# Altium schematic sheet NeuronSynapseVersion3 (1).SchDoc
size 431 x 279 mm; SheetNumber: 1; SheetTotal: 1; SPICEModelCacheKXTIQRLV: <root> / <DocumentId>KXTIQRLV</DocumentId> / </root>
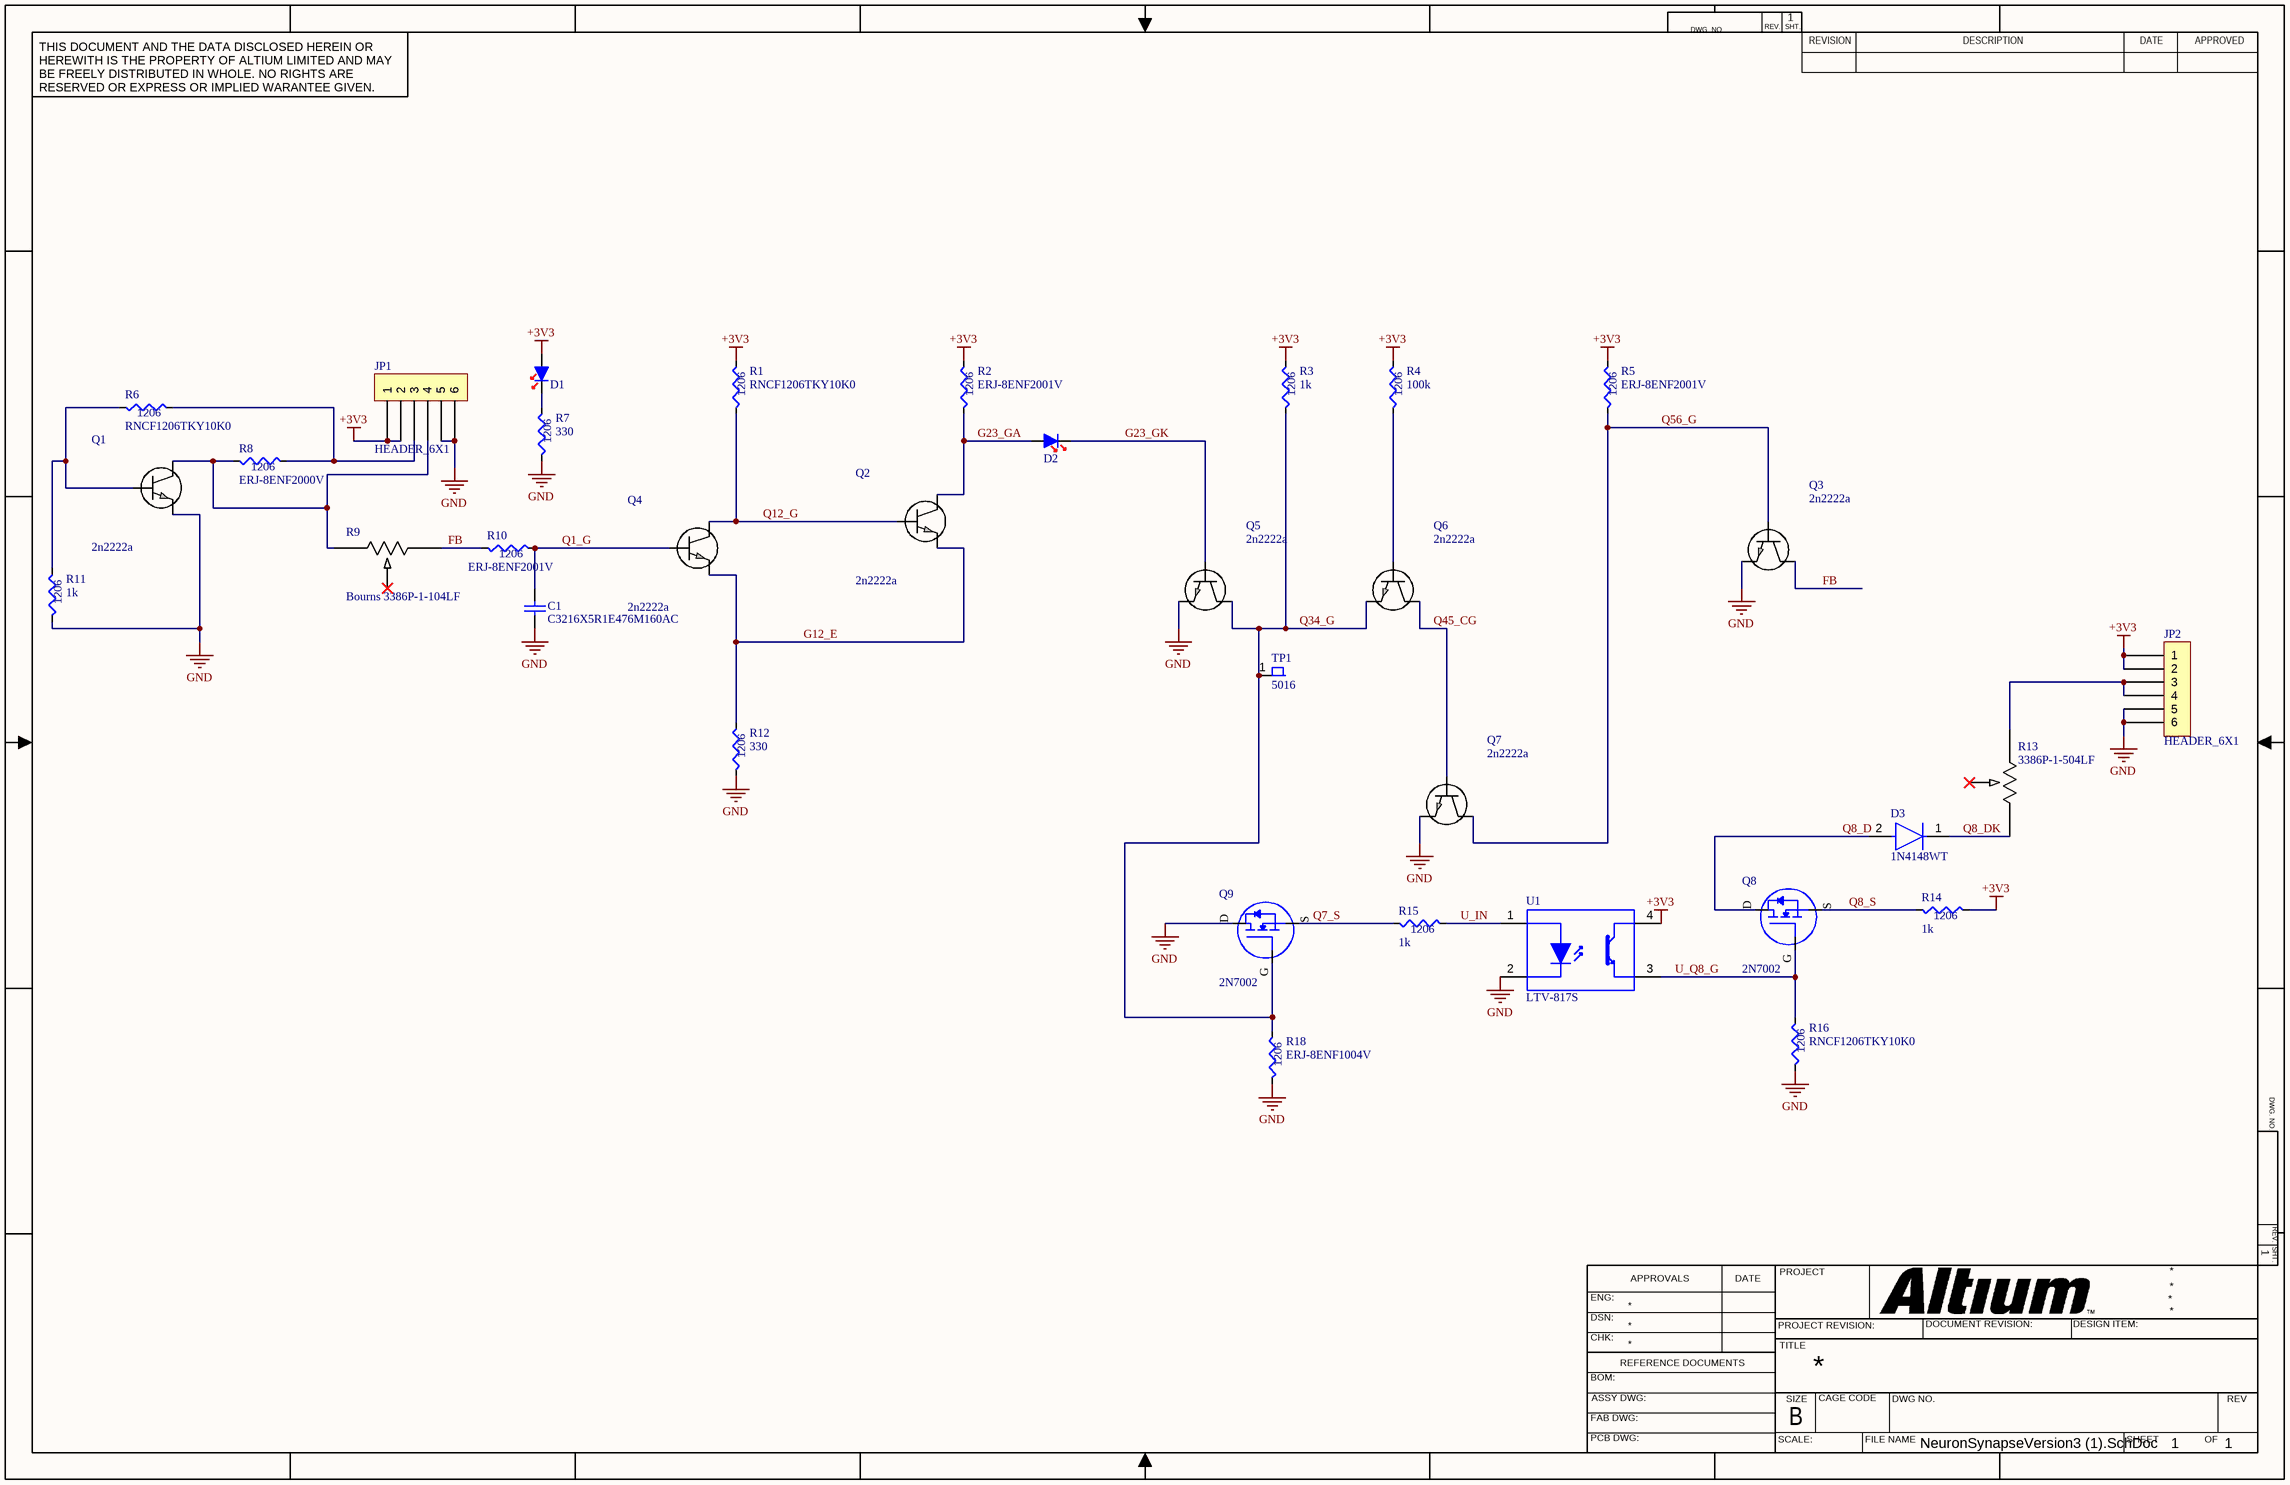
[diagram p0: NeuronSynapseVersion3 (1).SchDoc]

## Parts
C1  C3216X5R1E476M160AC  [C1206]
D1  AA3528SESK/J3  [2-PLCC-RED]  (value not drawn)
D2  AA3528SESK/J3  [2-PLCC-RED]  (value not drawn)
D3  1N4148WT  [FP-017AG-MFG]
JP1  HEADER_6X1  [HEADER1x6PITCH100]
JP2  HEADER_6X1  [HEADER1x6PITCH100]
Q1  2n2222a  [2n2222a-Footprint-1]
Q2  2n2222a  [2n2222a-Footprint-1]
Q3  2n2222a  [2n2222a-Footprint-1]
Q4  2n2222a  [2n2222a-Footprint-1]
Q5  2n2222a  [2n2222a-Footprint-1]
Q6  2n2222a  [2n2222a-Footprint-1]
Q7  2n2222a  [2n2222a-Footprint-1]
Q8  2N7002  [2N7002]
Q9  2N7002  [2N7002]
R1  RNCF1206TKY10K0  [R1206]
R2  ERJ-8ENF2001V  [R1206]
R3  1k  [R1206]
R4  100k  [R1206]
R5  ERJ-8ENF2001V  [R1206]
R6  RNCF1206TKY10K0  [R1206]
R7  330  [R1206]
R8  ERJ-8ENF2000V  [R1206]
R9  Bourns 3386P-1-104LF  [Bourns 3386P-1-104LF-Footprint-1]
R10  ERJ-8ENF2001V  [R1206]
R11  1k  [R1206]
R12  330  [R1206]
R13  3386P-1-504LF  [3386P-1-504LF-Footprint-1]
R14  1k  [R1206]
R15  1k  [R1206]
R16  RNCF1206TKY10K0  [R1206]
R18  ERJ-8ENF1004V  [R1206]
TP1  5016  [5016]
U1  LTV-817S  [LTST-LTV-817S-4_V]

## Nets
+3V3: D1.2 JP1.1 JP1.2 JP2.1 JP2.2 R1.2 R2.2 R3.2 R4.2 R5.2 R14.2 U1.4(COLLECTOR)
GND: C1.1 JP1.5 JP1.6 JP2.5 JP2.6 Q1.1(E) Q3.1(E) Q5.1(E) Q7.1(E) Q9.3(D) R7.1 R11.1 R12.1 R16.1 R18.1 U1.2(CATHODE)
FB: Q3.3(C) R9.1 R10.1
G12_E: Q2.1(E) Q4.1(E) R12.2
G23_GA: D2.2 Q2.3(C) R2.1
G23_GK: D2.1 Q5.2(B)
Q1_G: C1.2 Q4.2(B) R10.2
Q7_S: Q9.2(S) R15.1
Q8_D: D3.2(A) Q8.3(D)
Q8_DK: D3.1(C) R13.1
Q8_S: Q8.2(S) R14.1
Q12_G: Q2.2(B) Q4.3(C) R1.1
Q34_G: Q5.3(C) Q6.1(E) Q9.1(G) R3.1 R18.2 TP1.1
Q45_CG: Q6.3(C) Q7.2(B)
Q56_G: Q3.2(B) Q7.3(C) R5.1
U_IN: R15.2 U1.1(ANODE)
U_Q8_G: Q8.1(G) R16.2 U1.3(EMITTER)
NetD1_1: D1.1 R7.2
NetJP1_3: JP1.3 R6.2 R8.2
NetJP1_4: JP1.4 Q1.3(C) R8.1 R9.3
NetJP2_3: JP2.3 JP2.4 R13.3
NetQ1_2: Q1.2(B) R6.1 R11.2
NetQ6_2: Q6.2(B) R4.1

Not connected (* = marked no-connect by the designer): R9 2*; R13 2*

## Notes on the sheet
- DWG. NO.
- REV.
- SHT.
- THIS DOCUMENT AND THE DATA DISCLOSED HEREIN OR HEREWITH IS THE PROPERTY OF ALTIUM LIMITED AND MAY BE FREELY DISTRIBUTED IN WHOLE. NO RIGHTS ARE RESERVED OR EXPRESS OR IMPLIED WARANTEE GIVEN.
- REVISION
- DESCRIPTION
- DATE
- APPROVED
- ENG:
- APPROVALS
- PROJECT
- DSN:
- CHK:
- REFERENCE DOCUMENTS
- PROJECT REVISION:
- TITLE
- DOCUMENT REVISION:
- DESIGN ITEM:
- BOM:
- FAB DWG:
- PCB DWG:
- ASSY DWG:
- SCALE:
- SIZE
- B
- CAGE CODE
- FILE NAME
- DWG NO.
- SHEET
- OF
- REV
- (in symbol CMP-024-000033-4) 1206
- (in symbol CMP-024-000035-4) 1206
- (in symbol CMP-024-000036-3) 1206
- (in symbol CMP-024-000047-3) 1206
- (in symbol CMP-024-000048-3) 1206
- (in symbol CMP-024-000058-4) 1206
- (in symbol CMP-024-000097-3) 1206

## Library data of the parts
C1 = CMP-054-000061-1: CER 47uF 25V X5R 1206 2.082mOhm; Design Item ID: C3216X5R1E476M160AC; Source: Capacitors.SchLib
D1 D2 = CMP-043-000017-1: LED Red 2.2V 20mA; Made By: Kyle Marino; Design Item ID: AA3528SESK/J3; Source: Diodes.SchLib
D3 = CMP-00188-1: Rectifier Diode, 1 Phase, 1 Element, 0.15A, 100V V(RRM), Silicon; Manufacturer Lifecycle Status: ACTIVE; Max Surge Current: 4A; Current: 3A; Peak Reverse Current: 5µA; Element Configuration: Single; Average Rectified Current: 200mA; Power Dissipation: 500mW; Outside Diameter: 1.85mm; Reverse Recovery Time: 4ns; Voltage: 75V; Max Forward Surge Current (Ifsm): 2A; Polarity: Standard; Max Junction Temperature (Tj): 175°C; Forward Voltage: 1V; Number of Elements: 1; Value: 4pF; Introduction Date: 1999-01-01; Reverse Voltage: 100V; Mounting Technology: Through Hole; RoHS: Compliant; Max Repetitive Reverse Voltage (Vrrm): 100V; Lifecycle Status: Production; Harmonized Tariff Schedule (HTS) Code: 8541.10.00.70; REACH SVHC: Yes; Forward Current: 200mA; Output Current: 200mA; Termination: Axial; Country of Origin: Mainland China; Schedule B: 8541100070, 8541100070; Width: 6.35mm; Length: 6.35mm; Max Power Dissipation: 500mW; Height: 1.91mm; Voltage Rating (DC): 100V; Export Control Classification Number (ECCN) Code: EAR99; Weight: 4.535924g; Peak Non-Repetitive Surge Current: 4A; Pins: 2; Max Output current: 200mA; Radiation Hardening: No; Case/Package: Axial; China RoHS: Non-Compliant; Reverse Standoff Voltage: 100V; Number of Terminals: 2; Current Rating: 200mA; Max Reverse Voltage (DC): 100V; Min Operating Temperature: -55°C; Recovery Time: 4ns; Contact Plating: Tin; Max Operating Temperature: 175°C; Lead Free: Lead Free
JP1 JP2 = CMP-021-000031-1: HEADER VERT 6POS .100 TIN; Made By: Brennan Swanton; Reviewed By: Carter Allen; Design Item ID: HEADER_6X1; Source: Connectors.SchLib
Q1-Q7 = CMP-00187-1: Bipolar (BJT) Transistor NPN 40 V 600 mA 250MHz 625 mW Through Hole TO-92
Q8 Q9 = CMP-056-000001-1: MOSFET N-CH 60V 115 mA; Made by: Kyle Marino; Source: Transistors.SchLib; Design Item ID: 2N7002
R1 R6 R16 = CMP-024-000097-3: RES 10K OHM 0.01% 1/4W 1206; Made By: Jamie Smith; Design Item ID: RNCF1206TKY10K0; Source: Resistors.SchLib
R2 R5 R10 = CMP-024-000048-3: 2K OHM 1% 1/4W 1206; Reviewed By: Carter Allen; Made By: Brennan Swanton; Design Item ID: ERJ-8ENF2001V; Source: Resistors.SchLib
R3 R11 R14 R15 = CMP-024-000033-4: 1K OHM 1% 1/4W 1206; Reviewed By: Carter Allen; Made By: Brennan Swanton; Design Item ID: ERJ-8ENF1001V; Supplier Part Number 1: P1.00KFCT-ND; Source: Resistors.SchLib; Supplier 1: Digi-Key
R4 = CMP-024-000035-4: 100K OHM 1% 1/4W 1206; Reviewed By: Carter Allen; Made By: Brennan Swanton; Design Item ID: ERJ-8ENF1003V; Source: Resistors.SchLib
R7 R12 = CMP-024-000058-4: 330 OHM 1% 1/4W 1206; Reviewed By: Carter Allen; Made By: Brennan Swanton; Source: Resistors.SchLib; Supplier 1: Digi-Key; Design Item ID: ERJ-8ENF3300V; Supplier Part Number 1: P330FCT-ND
R8 = CMP-024-000047-3: 200 OHM 1% 1/4W 1206; Made By: Jamie Smith; Source: Resistors.SchLib; Design Item ID: ERJ-8ENF2000V
R9 = CMP-092-000045-1: 100 kOhms 0.5W, 1/2W PC Pins Through Hole Trimmer Potentiometer Cermet 1.0 Turn Top Adjustment
R13 = CMP-092-000044-1: Cermet Not Linear VERTICAL Trimmer Potentiometer 卤10% 280deg 500mW 85C; Value: 500kΩ
R18 = CMP-024-000036-3: 1M OHM 1% 1/4W 1206; Made By: Jamie Smith; Source: Resistors.SchLib; Design Item ID: ERJ-8ENF1004V
TP1 = CMP-053-000001-2: PC TEST POINT COMPACT SMT; Reviewed By: Adam Rising; Source: Misc.SchLib; Design Item ID: 5016
U1 = CMP-00026-00000-2: LTV Series Single Channel 35 V 5000 Vrms Transistor Output Optocoupler SMT-DIP-4; Made By: Diego Gomez Ruiz; Supplier 1: Digi-Key; Supplier Part Number 1: LTV-817S